# EAGLE design espism-v2 (EAGLE 6.5.0)
CNAME: An ISM to Wifi gateway; CREVISION: 2; DESIGNER: Johan Kanflo
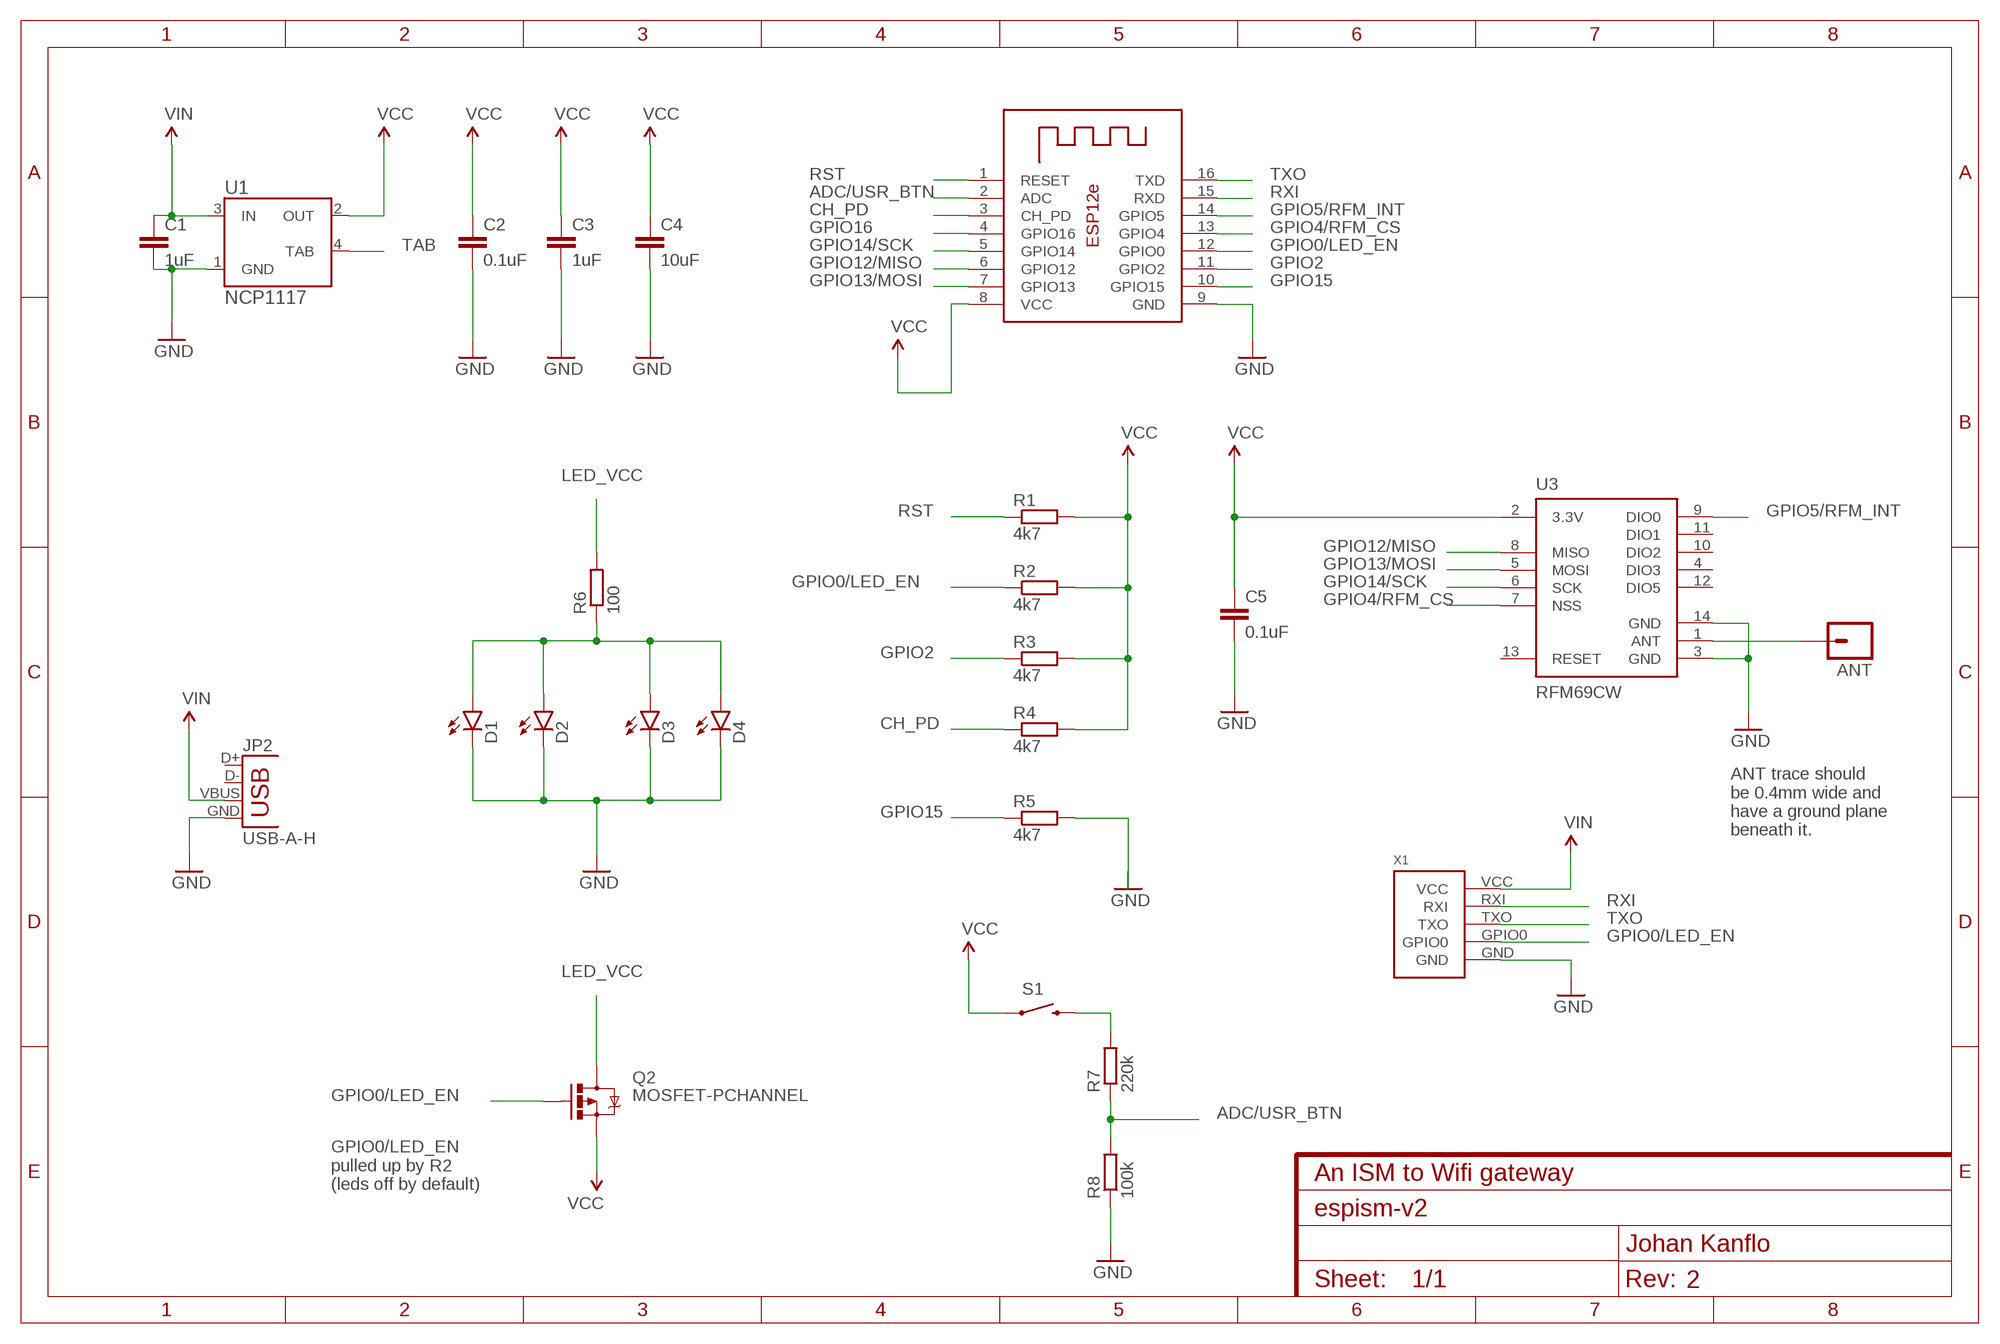
[diagram p0: schematic, sheet 1]

## Parts
ANT  M01PTH  [1X01]
C1  1uF  CAP0603-CAP  [0603-CAP]
C2  0.1uF  CAP0603-CAP  [0603-CAP]
C3  1uF  CAP0603-CAP  [0603-CAP]
C4  10uF  CAP0603-CAP  [0603-CAP]
C5  0.1uF  CAP0603-CAP  [0603-CAP]
D1  LED0603  [LED-0603]
D2  LED0603  [LED-0603]
D3  LED0603  [LED-0603]
D4  LED0603  [LED-0603]
JP2  USB-A-H  [USB-A-H]
Q2  MOSFET-PCHANNEL  [SOT23-3]
R1  4k7  R-EU_R0603  [R0603]
R2  4k7  R-EU_R0603  [R0603]
R3  4k7  R-EU_R0603  [R0603]
R4  4k7  R-EU_R0603  [R0603]
R5  4k7  R-EU_R0603  [R0603]
R6  100  R-EU_R0603  [R0603]
R7  220k  R-EU_R0603  [R0603]
R8  100k  R-EU_R0603  [R0603]
S1  SWITCH-MOMENTARY-2SMD-1101NE  [TACTILE-SWITCH-1101NE]
U1  NCP1117  [SOT223]
U2  ESP-12E  [ESP-12E]
U3  RFM69CW  [RFM69CW-XXXS2]
X1  ESPROGESPROG-DEVICE  [ESPROG]

## Nets
ADC/USR_BTN: R7.1 R8.2 U2.2(ADC)
CH_PD: R4.1 U2.3(CH_PD)
GND: C1.2 C2.2 C3.2 C4.2 C5.2 D1.C D2.C D3.C D4.C JP2.GND R5.2 R8.1 U1.1(GND) U2.9(GND) U3.3(GND) U3.14(GND) X1.GND
GPIO0/LED_EN: Q2.1(G) R2.1 U2.12(GPIO0) X1.GPIO0
GPIO2: R3.1 U2.11(GPIO2)
GPIO4/RFM_CS: U2.13(GPIO4) U3.7(NSS)
GPIO5/RFM_INT: U2.14(GPIO5) U3.9(DIO0)
GPIO12/MISO: U2.6(GPIO12) U3.8(MISO)
GPIO13/MOSI: U2.7(GPIO13) U3.5(MOSI)
GPIO14/SCK: U2.5(GPIO14) U3.6(SCK)
GPIO15: R5.1 U2.10(GPIO15)
GPIO16: U2.4(GPIO16)
LED_VCC: Q2.3(D) R6.2
N$1: ANT.1 U3.1(ANT)
N$2: D1.A D2.A D3.A D4.A R6.1
N$3: R7.2 S1.2
RST: R1.1 U2.1(RESET)
RXI: U2.15(RXD) X1.RXI
TAB: U1.4(TAB)
TXO: U2.16(TXD) X1.TXO
VCC: C2.1 C3.1 C4.1 C5.1 Q2.2(S) R1.2 R2.2 R3.2 R4.2 S1.1 U1.2(OUT) U2.8(VCC) U3.2(3.3V)
VIN: C1.1 JP2.VBUS U1.3(IN) X1.VCC
Unconnected: JP2.D+ JP2.D- U3.4(DIO3) U3.10(DIO2) U3.11(DIO1) U3.12(DIO5) U3.13(RESET)

## Notes on the sheet
- ANT trace should
  be 0.4mm wide and
  have a ground plane
  beneath it.
- GPIO0/LED_EN
  pulled up by R2
  (leds off by default)

## Library data of the parts
ANT = SparkFun-Connectors:M01: Header 1 Standard 1-pin 0.1" header. Use with straight break away headers (SKU : PRT-00116), right angle break away headers (PRT-00553), swiss pins (PRT-00743), machine pins (PRT-00117), and female headers (PRT-00115).
C1-C5 = SparkFun-Capacitors:CAP: Capacitor Standard 0603 ceramic capacitor, and 0.1" leaded capacitor.
D1-D4 = SparkFun-LED:LED: LEDs Standard schematic elements and footprints for 5mm, 3mm, 1206, and 0603 sized LEDs. 5mm - Spark Fun Electronics SKU : COM-00529 (and others)
JP2 = SparkFun-Connectors:USB: USB Connectors USB-B-PTH is fully proven SKU : PRT-00139/CONN-08278 USB-miniB is fully proven SKU : PRT-00587 USB-A-PCB is untested. USB-A-H is throughly reviewed, but untested. Spark Fun Electronics SKU : PRT-00437 USB-B-SMT is throughly reviewed, but untested. Needs silkscreen touching up. USB-A-S has not been used/tested USB-MB-H has not been used/tested USB-MICROB has been used. CONN-09505; PROD_ID: CONN-08367
Q2 = SparkFun-DiscreteSemi:MOSFET-PCHANNEL: Generic PMOSFET IRLML2244 - TRANS-11153 (SOT-23 -20V -4.3A) (1.Gate 2.Source 3.Drain) FQP27P06 - COM-10349 <http://www.sparkfun.com/products/10349> (TO-220 -60V -27A) (1.Gate 2.Source 3.Drain); PROD_ID: TRANS-08285
R1-R8 = resistor:R-EU_: RESISTOR, European symbol
S1 = SparkFun-Electromechanical:SWITCH-MOMENTARY-2: Various NO switches- pushbuttons, reed, etc; PROD_ID: SWCH-00815
U1 = ELL-i-PowerIC:NCP1117
U2 = kanflo:ESP-12E: ESP12e module This is a copy of AdaFruit's device with correct pin order for GPIO4 and GPIO5.
U3 = SparkFun-RF:RFM69
X1 = kanflo:ESPROG

## Board
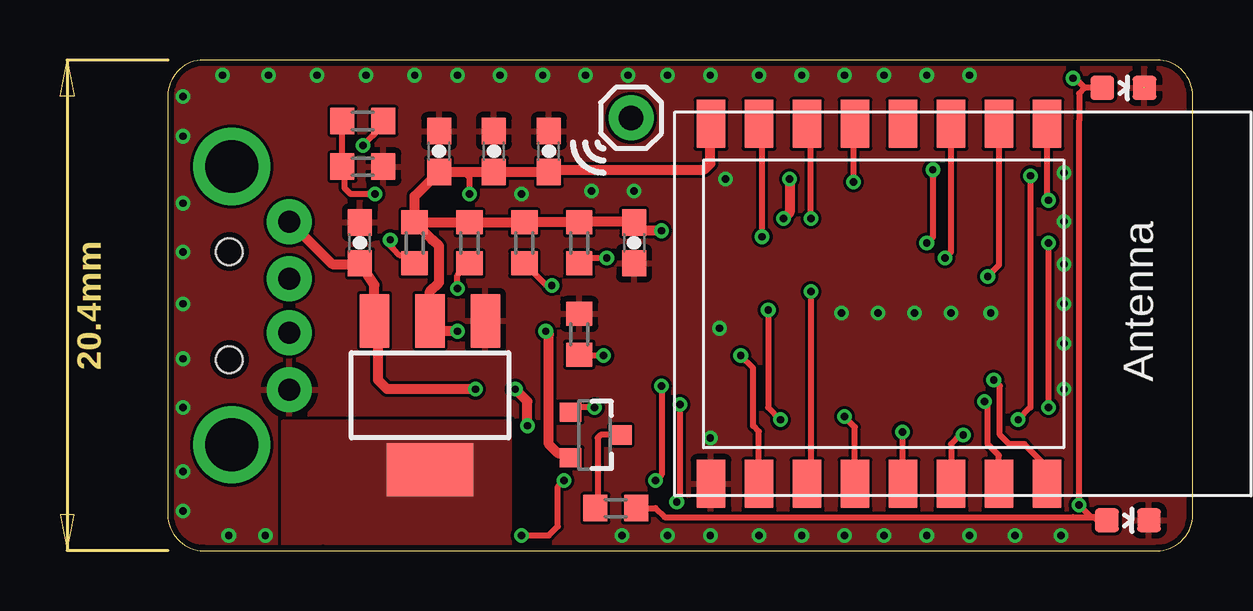
[diagram p1: board, top side]
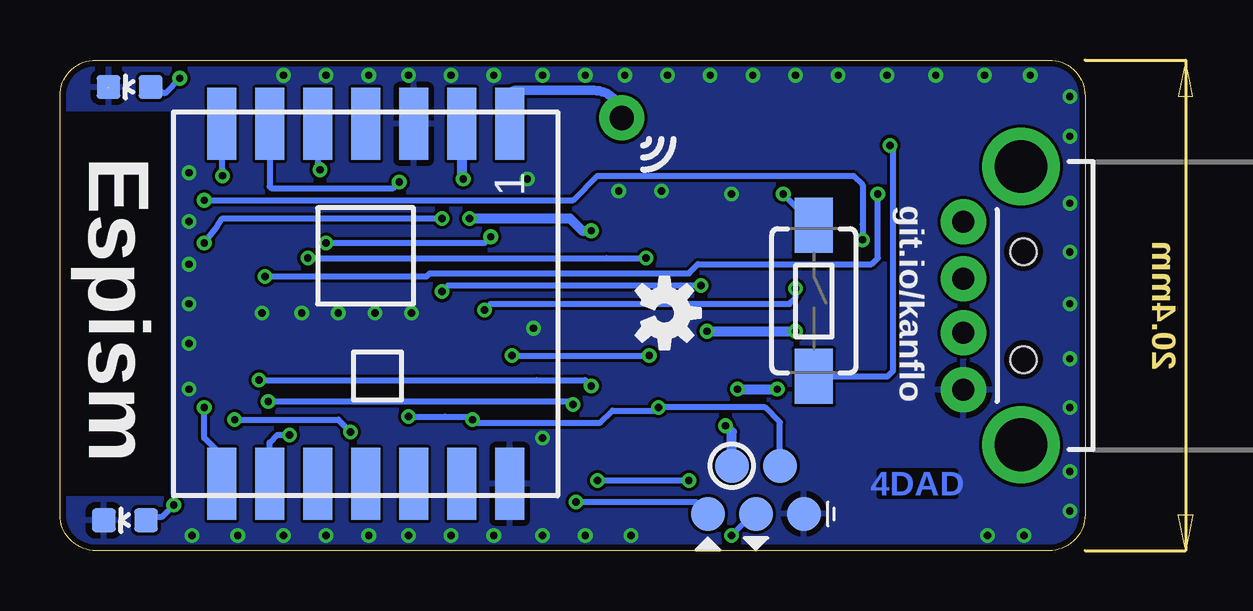
[diagram p2: board, bottom side, seen from below]

Size 42.71 x 20.45 mm. Coordinates in mm from the lower left corner, seen from the top.
Outline: 5.84,20.45 1.5,20.45 arc90 0,18.95 0,1.5 arc90 1.5,0 6.48,0 41.21,0 arc90 42.71,1.5 42.71,18.95 arc90 41.21,20.45 5.84,20.45
Copper layers (1*16): Top 0.035mm / dielectric 1.5mm / Bottom 0.035mm
Design rules "dirt_cheap_dirty_boards.v1": minimum track width 5mil, minimum drill 12mil, track to track 5mil, track to pad 5mil, pad to pad 5mil, via to via 5mil, smd to smd 0mil, copper to edge 10mil, drill to drill 10mil, minimum pad ring 10mil, minimum via ring 6mil, stop-mask expansion 2mil, vias tented up to drill 25mil, thermal gap 10mil

### Footprints (pad centres in the part's own frame; a part is rotated, then mirrored left to right if it is on the bottom)
1X01 = drill 1.016 pad 1.88: 1 0,0
0603-CAP = smd 1.1 x 1: 1 -0.85,0; 2 0.85,0
LED-0603 = smd 1 x 1: A 0,-0.877; C 0,0.877
USB-A-H = drill 0.914 pad 1.88: D+ 2.4,1.127; D- 2.4,-1.127; GND 2.4,3.5; VBUS 2.4,-3.5 | drill 2.2: GND2 0,-5.8; GND3 0,5.8 | hole 1.1: -0.1,2.25; -0.1,-2.25
SOT23-3 = smd 0.8 x 0.9: 1 -0.95,-1; 2 0.95,-1; 3 0,1.1
R0603 = smd 1 x 1.1: 1 -0.85,0; 2 0.85,0
TACTILE-SWITCH-1101NE = smd 2.3 x 1.6: 1 -3.15,0; 2 3.15,0
SOT223 = smd 1.219 x 2.235: 1 -2.311,-3.099; 2 0,-3.099; 3 2.311,-3.099 | smd 3.6 x 2.2: 4 0,3.099
ESP-12E = smd 2 x 1.2: 1 -7.5,4.5; 2 -7.5,2.5; 3 -7.5,0.5; 4 -7.5,-1.5; 5 -7.5,-3.5; 6 -7.5,-5.5; 7 -7.5,-7.5; 8 -7.5,-9.5; 9 7.5,-9.5; 10 7.5,-7.5; 11 7.5,-5.5; 12 7.5,-3.5; 13 7.5,-1.5; 14 7.5,0.5; 15 7.5,2.5; 16 7.5,4.5
RFM69CW-XXXS2 = smd 3 x 1.2: 1 -7.5,6; 2 -7.5,4; 3 -7.5,2; 4 -7.5,0; 5 -7.5,-2; 6 -7.5,-4; 7 -7.5,-6; 8 7.5,-6; 9 7.5,-4; 10 7.5,-2; 11 7.5,0; 12 7.5,2; 13 7.5,4; 14 7.5,6
ESPROG = smd 1.422 x 1.422: GND -1,-2; GPIO0 1,-1; RXI -1,2; TXO -1,0; VCC 1,1

### Placement (x,y rotation side)
ANT  19.3,18.03 0 top
C1  8,12.83 90 top
C2  15.88,16.64 90 top
C3  13.59,16.64 90 top
C4  11.3,16.64 90 top
C5  19.43,12.83 270 top
D1  39.81,19.32 90 bottom
D2  39.82,19.29 270 top
D3  40,1.27 270 top
D4  40,1.27 90 bottom
JP2  2.67,10.21 180 bottom
Q2  17.78,4.83 270 top
R1  10.29,12.83 90 top
R2  12.57,12.83 90 top
R3  14.86,12.83 90 top
R4  17.14,12.83 90 top
R5  17.14,9.02 90 top
R6  18.67,1.78 180 top
R7  8.13,17.91 0 top
R8  8.13,16 180 top
S1  11.3,10.41 270 bottom
U1  10.92,6.48 180 top
U2  32.13,10.29 270 top
U3  29.97,10.29 270 bottom
U$1  [OSHW-LOGO-S]  17.53,9.91 270 bottom
X1  13.72,2.54 90 bottom

### Tracks (layer width: path | path; a pad name or v marks a point on that pad's centre or on a via)
ADC/USR_BTN  (via drill 0.3 pad 0.25)
  Top 0.254: U2.2 34.63,11.9 v34.16,11.43 | v8.64,14.86 7.62,14.86 7.37,15.11 7.37,15.91 R8.2 R7.1
  Bottom 0.254: v34.16,11.43 27.43,11.43 27.3,11.56 16.51,11.56 16.13,11.94 8.89,11.94 8.64,12.19 v8.64,14.86
CH_PD  (via drill 0.3 pad 0.25)
  Top 0.254: U2.3 32.63,12.45 v32.38,12.19 | v18.29,12.19 17.23,12.19 R4.1
  Bottom 0.254: v18.29,12.19 19.94,12.19 v32.38,12.19
GND  (via drill 0.3 pad 0.25)  (1 unrouted)
  other vias: 22.61,4.7 37.21,0.64 33.4,19.81 31.62,19.81 29.84,19.81 28.19,19.81 26.42,19.81 24.64,19.81 35.31,0.64 33.4,0.64 31.62,0.64 29.84,0.64 28.19,0.64 26.42,0.64 24.64,0.64 22.61,0.64 20.83,0.64 13.84,19.81 22.61,19.81 20.83,19.81 19.18,19.81 17.4,19.81 15.62,19.81 37.34,8.64 37.34,10.29 37.34,11.94 37.34,13.72 37.34,15.75 28.07,9.91 29.59,9.91 31.12,9.91 32.64,9.91 34.29,9.91 4.06,0.64 2.54,0.64 0.63,1.65 0.63,3.3 12.06,19.81 10.29,19.81 8.25,19.81 6.22,19.81 4.19,19.81 2.29,19.81 0.63,18.92 0.63,17.27 0.63,14.48 0.63,5.97 0.63,8 0.63,12.45 0.63,10.29 18.92,0.64 19.43,14.99 17.65,14.99 14.73,14.86 22.99,9.27 23.24,15.49 37.34,6.73
  pour Top (rank 6): 0.01,20.48 42.71,20.48 42.71,-0.02 0.01,-0.02
  pour Bottom (rank 6): 0.01,20.48 42.71,20.48 42.71,-0.02 0.01,-0.02
GPIO0/LED_EN  (via drill 0.3 pad 0.25)
  Top 0.254: U2.12 28.63,5.15 v28.19,5.59 | v25.02,10.03 25.02,5.97 v25.53,5.46 | v12.06,10.92 12.06,11.47 R2.1 | v17.78,5.97 16.97,5.97 Q2.1
  Bottom 0.254: v28.19,5.59 26.67,5.59 25.65,5.59 v25.53,5.46 25.4,5.33 20.19,5.33 19.68,5.84 17.91,5.84 v17.78,5.97 13.34,5.97 12.72,5.35 X1.GPIO0 | v25.02,10.03 24.77,10.29 14.86,10.29 12.32,10.29 12.06,10.54 v12.06,10.92
GPIO2  (via drill 0.3 pad 0.25)
  Top 0.254: v16,11.05 15.79,11.05 R3.1 | v26.8,10.79 26.8,2.95 U2.11
  Bottom 0.254: v16,11.05 26.54,11.05 v26.8,10.79
GPIO4/RFM_CS  (via drill 0.3 pad 0.25)
  Top 0.254: v35.94,15.62 35.94,5.97 v35.43,5.46 | v30.61,4.95 30.61,2.81 U2.13
  Bottom 0.254: U3.7 35.97,15.65 v35.94,15.62 | v35.43,5.46 31.12,5.46 v30.61,4.95
GPIO5/RFM_INT  (via drill 0.3 pad 0.25)
  Top 0.254: v33.15,4.83 33.02,4.83 32.64,4.44 U2.14
  Bottom 0.254: v33.15,4.83 33.66,4.83 33.97,4.51 U3.9
GPIO12/MISO  (via drill 0.3 pad 0.25)
  Top 0.254: v36.7,5.97 v36.7,12.83 | v26.8,13.84 26.8,17.62 U2.6
  Bottom 0.254: U3.8 35.97,3.97 36.7,4.7 v36.7,5.97 | v36.7,12.83 36.2,13.46 35.94,13.84 27.3,13.84 v26.8,13.84
GPIO13/MOSI  (via drill 0.3 pad 0.25)
  Top 0.254: v31.88,15.87 31.88,13.08 v31.62,12.83 | v24.77,13.08 24.77,17.65 U2.7
  Bottom 0.254: U3.5 31.97,15.97 v31.88,15.87 | v31.62,12.83 25.02,12.83 v24.77,13.08
GPIO14/SCK  (via drill 0.3 pad 0.25)
  Top 0.254: v28.57,15.37 28.57,17.73 U2.5
  Bottom 0.254: U3.6 33.97,15.18 33.91,15.11 28.83,15.11 v28.57,15.37
GPIO15  (via drill 0.3 pad 0.25)
  Top 0.254: U2.10 24.63,4.96 24.38,5.21 24.38,7.62 v23.88,8.13 | v18.16,8.13 17.18,8.13 R5.1
  Bottom 0.254: v23.88,8.13 v18.16,8.13
LED_VCC
  Top 0.254: Q2.3 18.03,4.83 17.91,4.7 17.91,1.87 R6.2
N$1
  Bottom 0.254: 23.85,17.91 U3.1 23.58,17.4
  Bottom 0.4: ANT.1 arc-90 20.45,19.18 23.24,19.18 23.75,19.18 arc-90 23.97,18.95 U3.1
N$2  (via drill 0.3 pad 0.25)
  Top 0.254: R6.1 20.32,1.78 20.7,1.4 37.72,1.4 38.61,1.4 | 38.61,1.4 39,1.4 | 39,1.4 D3.A 38.73,1.27 38.61,1.4 | 39,1.4 38.61,1.4 | 38.61,1.4 38.48,1.4 | 38.48,1.4 v37.97,1.9 | 38.61,1.4 38.48,1.4 | 38.48,1.4 v37.97,1.9 | v37.97,1.9 37.97,17.91 37.97,19.05 38.21,19.29 | D2.A 38.21,19.29 | v37.72,19.68 37.81,19.68 38.21,19.29
  Bottom 0.254: v37.97,1.9 38.48,1.4 39.12,1.4 39.12,1.39 D3.A | D1.A 38.34,19.07 v37.72,19.68
N$3  (via drill 0.3 pad 0.25)
  Top 0.254: v8.13,16.89 8.51,17.27 8.64,17.4 8.64,17.57 R7.2
  Bottom 0.254: S1.2 8.23,7.26 8,7.49 8,16.76 v8.13,16.89
RST  (via drill 0.3 pad 0.25)
  Top 0.254: U2.1 36.63,14.68 v36.7,14.61 | v9.27,12.95 9.14,12.83 9.4,12.57 9.65,12.32 9.95,12.32 R1.1
  Bottom 0.254: v36.7,14.61 21.34,14.61 20.32,15.62 9.65,15.62 9.27,15.24 9.27,13.59 v9.27,12.95
RXI  (via drill 0.3 pad 0.25)
  Top 0.254: U2.15 34.63,3.98 34.16,4.44 34.16,6.1 v34.04,6.22 | v21.34,6.1 21.34,2.16 v21.21,2.03
  Bottom 0.254: v34.04,6.22 21.46,6.22 v21.34,6.1 | v21.21,2.03 16.21,2.03 X1.RXI
TAB
  pour Top (no thermals): 14.22,5.33 4.83,5.33 4.83,0 14.22,0
TXO  (via drill 0.3 pad 0.25)
  Top 0.254: U2.16 36.63,3.5 35.69,4.44 35.05,4.44 34.67,4.83 34.67,6.86 v34.42,7.11 | v20.57,6.86 20.57,3.18 v20.32,2.92 | v14.73,0.64 15.88,0.64 16.26,1.02 16.26,2.67 v16.51,2.92
  Bottom 0.254: v34.42,7.11 22.86,7.11 20.83,7.11 v20.57,6.86 | X1.TXO 13.83,1.54 v14.73,0.64 | v16.51,2.92 v20.32,2.92
VCC  (via drill 0.3 pad 0.25)
  Top 0.254: v12.57,14.86 12.57,15.53 12.32,15.79
  Top 0.406: 22.36,17.79 U2.8 22.48,17.64 22.48,17.27 22.61,17.14 22.61,16.13 22.35,15.87 15.96,15.87 C2.1 C3.1 12.32,15.79 C4.1 10.29,14.77 R1.2 | R1.2 R2.2 R3.2 R4.2 17.18,13.72 19.18,13.72 19.3,13.84 19.6,13.84 C5.1 19.77,13.33 v20.57,13.33 | R1.2 11.01,12.95 11.05,12.95 11.3,12.7 11.3,11.18 10.92,10.79 U1.2 11.35,9.14 v12.06,9.14 | v25.91,15.49 25.91,14.1 v25.65,13.84 | Q2.2 16.59,4.06 16.26,4.06 15.88,4.44 15.88,9.02 v15.75,9.14
  Bottom 0.254: S1.1 11.3,13.59 v12.57,14.86
  Bottom 0.406: U3.2 25.97,15.56 v25.91,15.49 | v25.65,13.84 21.46,13.84 20.95,13.33 v20.57,13.33 | v12.06,9.14 14.99,9.14 v15.75,9.14
VIN  (via drill 0.3 pad 0.25)
  Top 0.406: 8.51,9.47 U1.3 | U1.3 8.61,11.06 C1.1 7.96,11.94 6.86,11.94 5.08,13.71 JP2.VBUS | v14.99,5.21 14.99,6.22 v14.48,6.73 | v12.83,6.73 9.14,6.73 8.76,7.11 8.76,9.42 U1.3
  Bottom 0.406: X1.VCC 14.72,4.94 v14.99,5.21 | v14.48,6.73 v12.83,6.73

### Text on the board
Bottom: 4DAD
bNames: git.io/kanflo | Espism